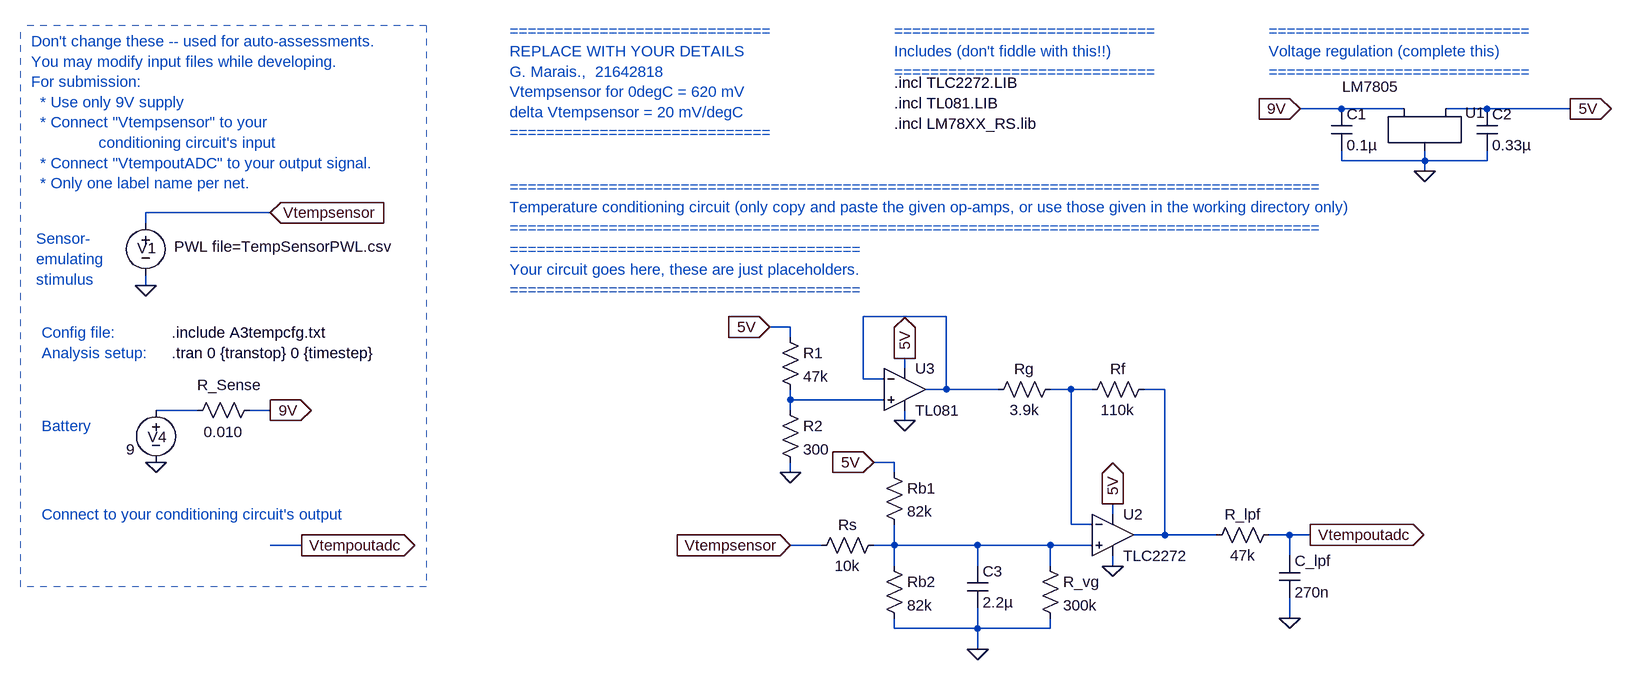
[diagram p0: schematic E344_A3_temp.asc]
E344_A3_temp.asc, the LTspice schematic file:
Version 4
SHEET 1 1824 680
WIRE -272 -1280 -336 -1280
WIRE -176 -1280 -272 -1280
WIRE -48 -1280 -112 -1280
WIRE 80 -1280 -48 -1280
WIRE -272 -1200 -272 -1216
WIRE -144 -1200 -144 -1216
WIRE -144 -1200 -272 -1200
WIRE -48 -1200 -48 -1216
WIRE -48 -1200 -144 -1200
WIRE -144 -1184 -144 -1200
WIRE -1920 -1120 -2112 -1120
WIRE -2112 -1104 -2112 -1120
WIRE -2112 -1008 -2112 -1024
WIRE -880 -960 -1008 -960
WIRE -1120 -944 -1152 -944
WIRE -1120 -928 -1120 -944
WIRE -944 -880 -944 -896
WIRE -1008 -864 -1008 -960
WIRE -976 -864 -1008 -864
WIRE -880 -848 -880 -960
WIRE -880 -848 -912 -848
WIRE -800 -848 -880 -848
WIRE -688 -848 -720 -848
WIRE -656 -848 -688 -848
WIRE -544 -848 -576 -848
WIRE -1120 -832 -1120 -848
WIRE -976 -832 -1120 -832
WIRE -2032 -816 -2096 -816
WIRE -1920 -816 -1952 -816
WIRE -1120 -816 -1120 -832
WIRE -944 -800 -944 -816
WIRE -960 -736 -992 -736
WIRE -1120 -720 -1120 -736
WIRE -960 -720 -960 -736
WIRE -624 -656 -624 -672
WIRE -688 -640 -688 -848
WIRE -656 -640 -688 -640
WIRE -544 -624 -544 -848
WIRE -544 -624 -592 -624
WIRE -464 -624 -544 -624
WIRE -352 -624 -384 -624
WIRE -320 -624 -352 -624
WIRE -1872 -608 -1920 -608
WIRE -1072 -608 -1120 -608
WIRE -960 -608 -960 -640
WIRE -960 -608 -992 -608
WIRE -832 -608 -960 -608
WIRE -720 -608 -832 -608
WIRE -656 -608 -720 -608
WIRE -352 -592 -352 -624
WIRE -960 -576 -960 -608
WIRE -832 -576 -832 -608
WIRE -720 -576 -720 -608
WIRE -624 -576 -624 -592
WIRE -352 -496 -352 -528
WIRE -960 -480 -960 -496
WIRE -832 -480 -832 -512
WIRE -832 -480 -960 -480
WIRE -720 -480 -720 -496
WIRE -720 -480 -832 -480
WIRE -832 -448 -832 -480
FLAG -2112 -1008 0
FLAG -1920 -1120 Vtempsensor
IOPIN -1920 -1120 In
FLAG -1920 -816 9V
IOPIN -1920 -816 Out
FLAG -2096 -736 0
FLAG -336 -1280 9V
IOPIN -336 -1280 In
FLAG -1120 -608 Vtempsensor
IOPIN -1120 -608 In
FLAG -144 -1184 0
FLAG 80 -1280 5V
IOPIN 80 -1280 Out
FLAG -320 -624 Vtempoutadc
IOPIN -320 -624 Out
FLAG -624 -576 0
FLAG -944 -800 0
FLAG -624 -672 5V
IOPIN -624 -672 Out
FLAG -944 -896 5V
IOPIN -944 -896 Out
FLAG -1872 -608 Vtempoutadc
IOPIN -1872 -608 Out
FLAG -1152 -944 5V
IOPIN -1152 -944 In
FLAG -1120 -720 0
FLAG -992 -736 5V
IOPIN -992 -736 In
FLAG -832 -448 0
FLAG -352 -496 0
SYMBOL voltage -2112 -1120 R0
WINDOW 123 0 0 Left 0
WINDOW 39 0 0 Left 0
WINDOW 3 44 52 Left 2
WINDOW 0 -13 54 Left 2
SYMATTR Value PWL file=TempSensorPWL.csv
SYMATTR InstName V1
SYMBOL voltage -2096 -832 R0
WINDOW 123 24 44 Left 2
WINDOW 39 0 0 Left 0
WINDOW 3 -46 76 Left 2
WINDOW 0 -13 57 Left 2
SYMATTR Value 9
SYMATTR InstName V4
SYMBOL res -1936 -832 R90
WINDOW 0 -7 47 VBottom 2
WINDOW 3 34 56 VTop 2
SYMATTR InstName R_Sense
SYMATTR Value 0.010
SYMBOL LM7805 -144 -1264 R0
WINDOW 3 -83 -66 Top 2
SYMATTR InstName U1
SYMBOL opamp2 -624 -688 R0
SYMATTR InstName U2
SYMATTR Value TLC2272
SYMATTR SpiceModel TLC2272
SYMBOL opamp2 -944 -912 R0
SYMATTR InstName U3
SYMATTR Value TL081
SYMATTR SpiceModel TL081
SYMBOL cap -288 -1280 R0
SYMATTR InstName C1
SYMATTR Value 0.1µ
SYMBOL cap -64 -1280 R0
SYMATTR InstName C2
SYMATTR Value 0.33µ
SYMBOL res -1136 -944 R0
SYMATTR InstName R1
SYMATTR Value 47k
SYMBOL res -1136 -832 R0
SYMATTR InstName R2
SYMATTR Value 300
SYMBOL res -704 -864 R90
WINDOW 0 0 56 VBottom 2
WINDOW 3 32 56 VTop 2
SYMATTR InstName Rg
SYMATTR Value 3.9k
SYMBOL res -560 -864 R90
WINDOW 0 0 56 VBottom 2
WINDOW 3 32 56 VTop 2
SYMATTR InstName Rf
SYMATTR Value 110k
SYMBOL res -368 -640 R90
WINDOW 0 0 56 VBottom 2
WINDOW 3 32 56 VTop 2
SYMATTR InstName R_lpf
SYMATTR Value 47k
SYMBOL res -736 -592 R0
SYMATTR InstName R_vg
SYMATTR Value 300k
SYMBOL res -976 -592 R0
SYMATTR InstName Rb2
SYMATTR Value 82k
SYMBOL res -976 -736 R0
SYMATTR InstName Rb1
SYMATTR Value 82k
SYMBOL cap -848 -576 R0
SYMATTR InstName C3
SYMATTR Value 2.2µ
SYMBOL cap -368 -592 R0
SYMATTR InstName C_lpf
SYMATTR Value 270n
SYMBOL res -976 -624 R90
WINDOW 0 0 56 VBottom 2
WINDOW 3 32 56 VTop 2
SYMATTR InstName Rs
SYMATTR Value 10k
TEXT -2072 -904 Left 2 !.tran 0 {transtop} 0 {timestep}
TEXT -2072 -936 Left 2 !.include A3tempcfg.txt
TEXT -2288 -1384 Left 2 ;Don't change these -- used for auto-assessments.\nYou may modify input files while developing.\nFor submission: \n  * Use only 9V supply \n  * Connect "Vtempsensor" to your \n               conditioning circuit's input\n  * Connect "VtempoutADC" to your output signal.\n  * Only one label name per net.
TEXT -2272 -936 Left 2 ;Config file:
TEXT -2272 -904 Left 2 ;Analysis setup:
TEXT -2272 -792 Left 2 ;Battery
TEXT -2280 -1080 Left 2 ;Sensor-\nemulating \nstimulus
TEXT -1552 -1400 Left 2 ;=============================\nREPLACE WITH YOUR DETAILS\nG. Marais.,  21642818\nVtempsensor for 0degC = 620 mV\ndelta Vtempsensor = 20 mV/degC\n=============================
TEXT -1552 -1160 Left 2 ;==========================================================================================\nTemperature conditioning circuit (only copy and paste the given op-amps, or use those given in the working directory only)\n==========================================================================================
TEXT -384 -1400 Left 2 ;=============================\nVoltage regulation (complete this)\n=============================
TEXT -960 -1320 Left 2 !.incl TLC2272.LIB\n.incl TL081.LIB\n.incl LM78XX_RS.lib
TEXT -2272 -656 Left 2 ;Connect to your conditioning circuit's output
TEXT -960 -1400 Left 2 ;=============================\nIncludes (don't fiddle with this!!)\n=============================
TEXT -1552 -1064 Left 2 ;=======================================\nYour circuit goes here, these are just placeholders.\n=======================================
LINE Normal -2304 -544 -2304 -1408 1
LINE Normal -1680 -1408 -1680 -544 1
LINE Normal -1680 -544 -2304 -544 1
LINE Normal -1680 -1408 -2304 -1408 1

The netlist it stands for:
* E344_A3_temp.asc
V1 Vtempsensor 0 PWL file=TempSensorPWL.csv
V4 N005 0 9
R_Sense 9V N005 0.010
XU1 9V 0 5V LM7805
XU2 N006 N002 5V 0 N003 TLC2272 TLC2272  ; pins In+ In- V+ V- OUT
XU3 N004 N001 5V 0 N001 TL081 TL081  ; pins In+ In- V+ V- OUT
C1 9V 0 0.1µ
C2 5V 0 0.33µ
R1 5V N004 47k
R2 N004 0 300
Rg N002 N001 3.9k
Rf N003 N002 110k
R_lpf Vtempoutadc N003 47k
R_vg N006 0 300k
Rb2 N006 0 82k
Rb1 5V N006 82k
C3 N006 0 2.2µ
C_lpf Vtempoutadc 0 270n
Rs N006 Vtempsensor 10k
.tran 0 {transtop} 0 {timestep}
.include A3tempcfg.txt
* Don't change these -- used for auto-assessments.
* You may modify input files while developing.
* For submission:
*   * Use only 9V supply
*   * Connect "Vtempsensor" to your
*                conditioning circuit's input
*   * Connect "VtempoutADC" to your output signal.
*   * Only one label name per net.
* Config file:
* Analysis setup:
* Battery
* Sensor-
* emulating
* stimulus
* =============================
* REPLACE WITH YOUR DETAILS
* G. Marais.,  21642818
* Vtempsensor for 0degC = 620 mV
* delta Vtempsensor = 20 mV/degC
* =============================
* ==========================================================================================
* Temperature conditioning circuit (only copy and paste the given op-amps, or use those given in the working directory only)
* ==========================================================================================
* =============================
* Voltage regulation (complete this)
* =============================
.incl TLC2272.LIB
.incl TL081.LIB
.incl LM78XX_RS.lib
* Connect to your conditioning circuit's output
* =============================
* Includes (don't fiddle with this!!)
* =============================
* =======================================
* Your circuit goes here, these are just placeholders.
* =======================================
.backanno
.end